# Altium schematic sheet PWR_Switch_PCB.SchDoc
size A1
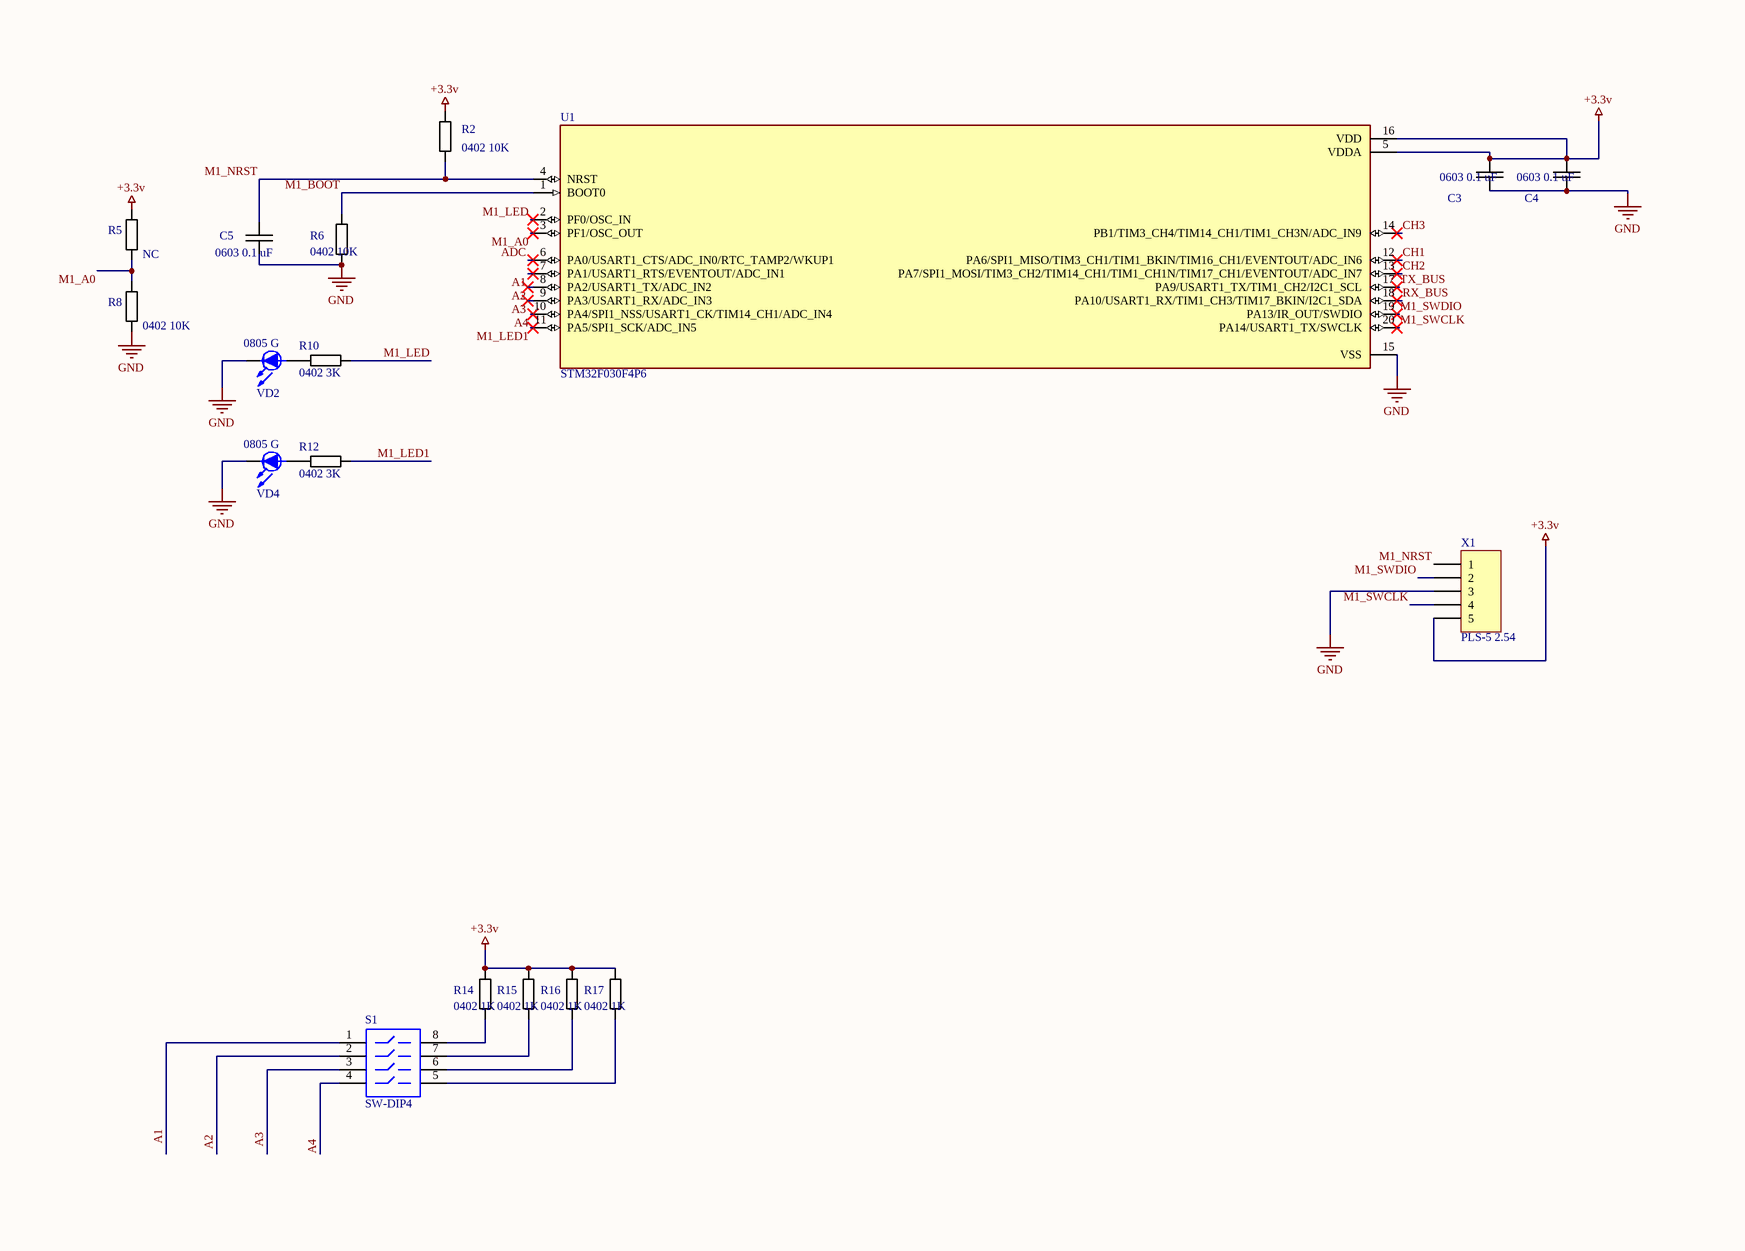
[diagram p0: PWR_Switch_PCB.SchDoc, top left]
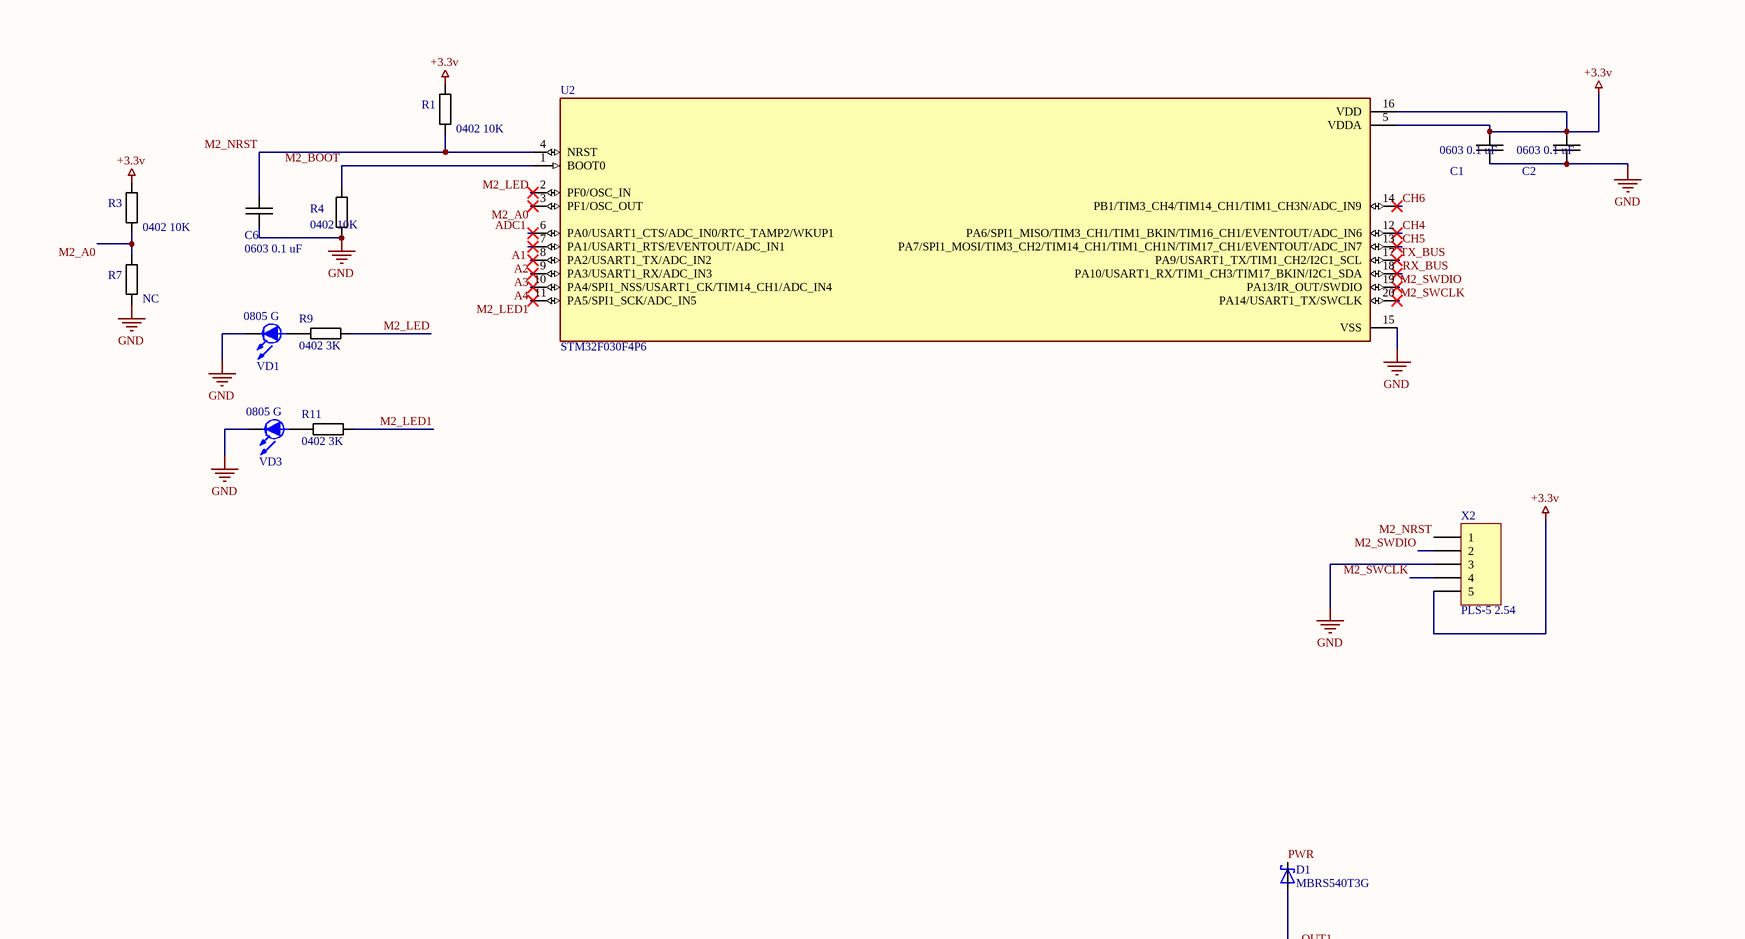
[diagram p1: PWR_Switch_PCB.SchDoc, top right]
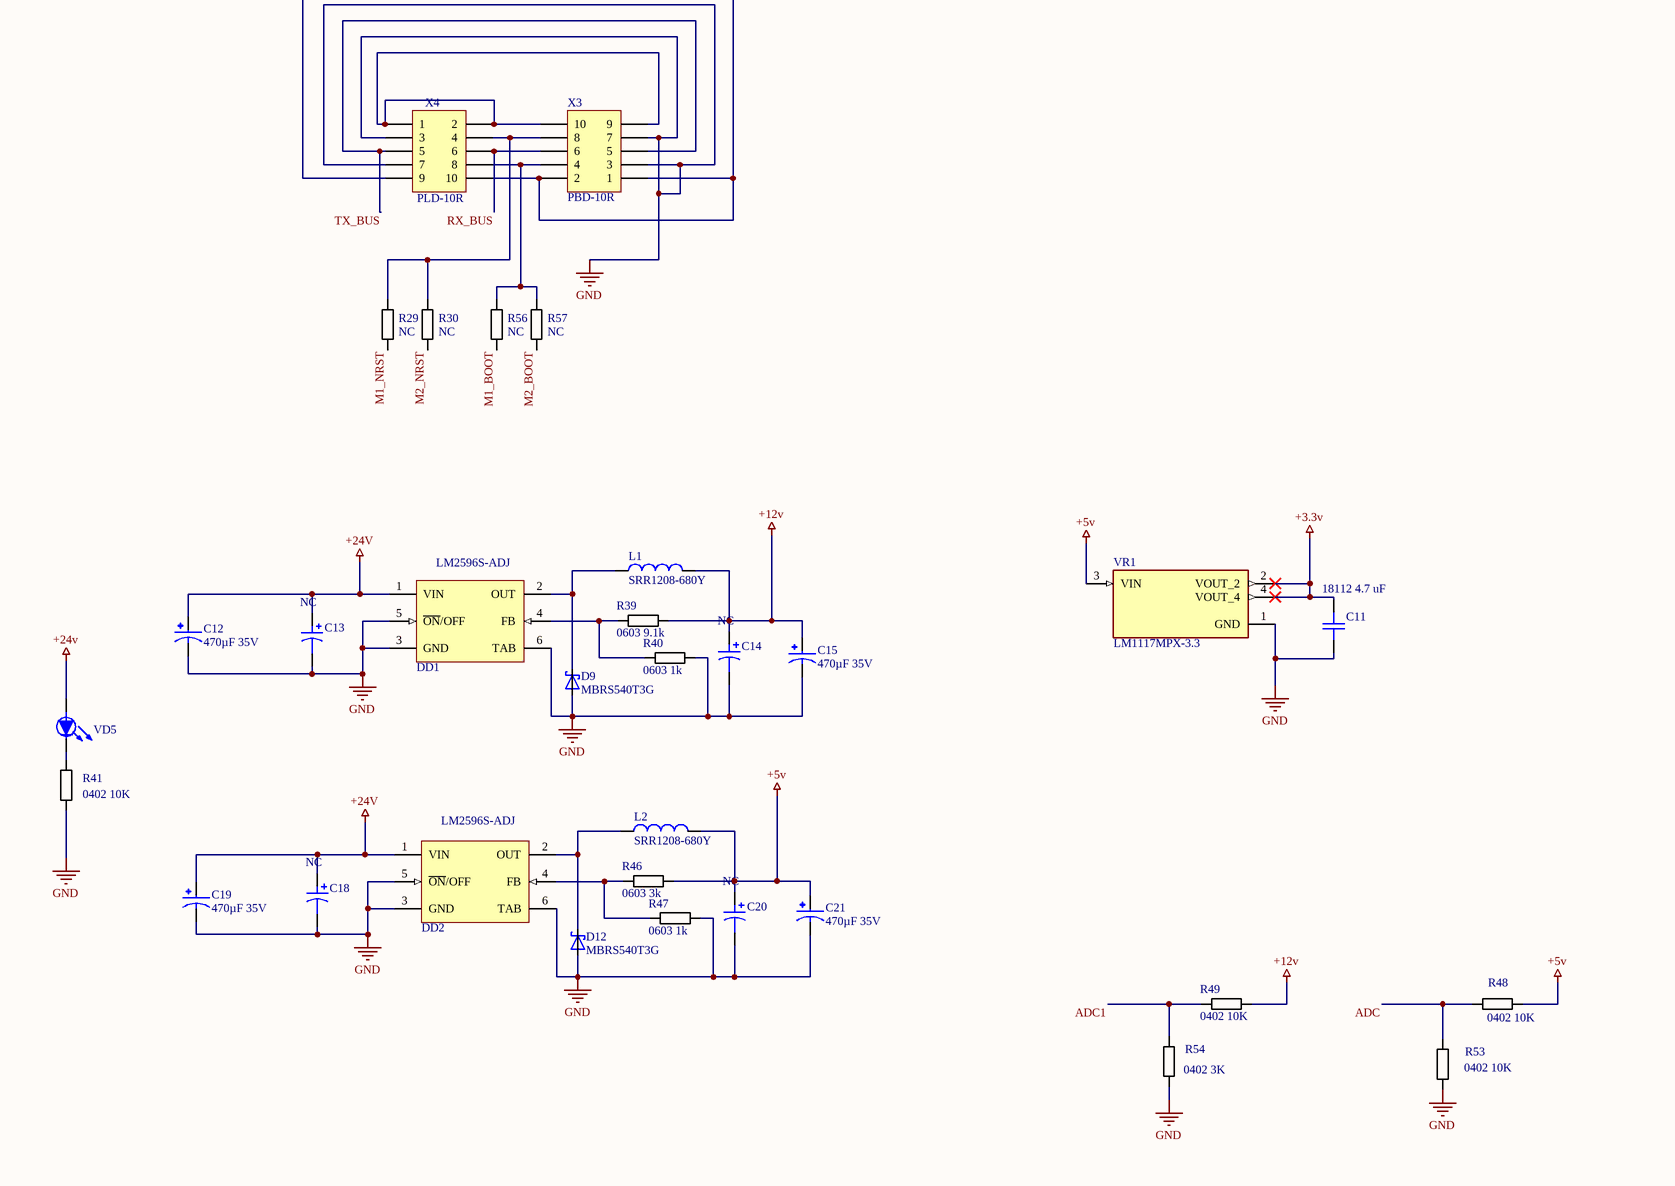
[diagram p2: PWR_Switch_PCB.SchDoc, bottom left]
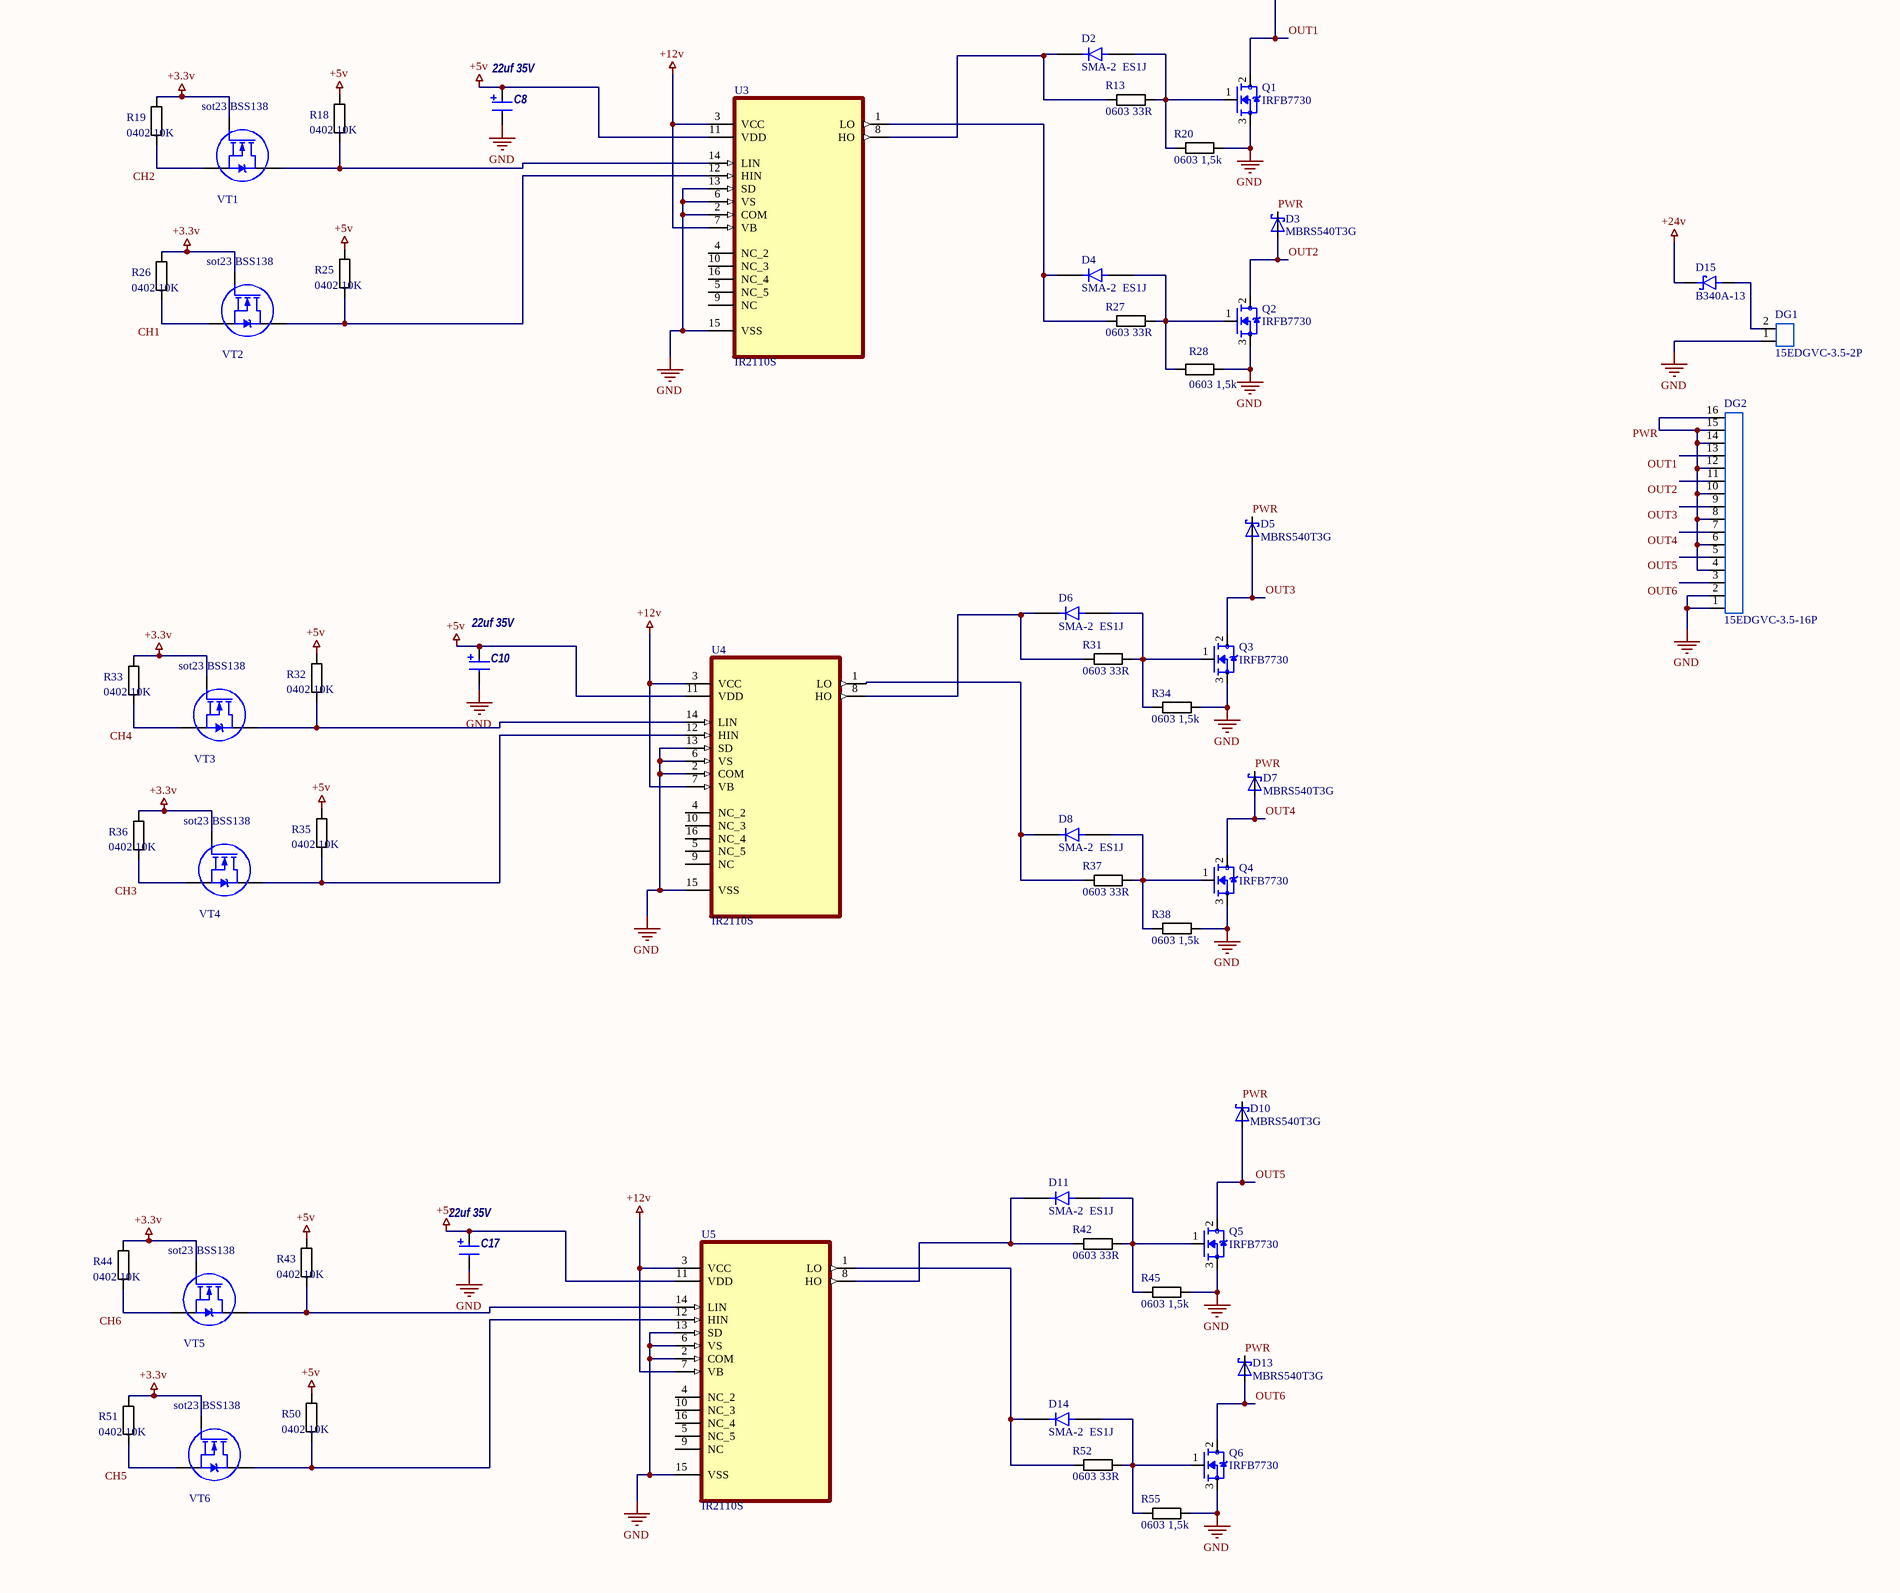
[diagram p3: PWR_Switch_PCB.SchDoc, bottom right]

## Parts
C1  0603 0.1 uF  [CAPACITOR 0603]
C2  0603 0.1 uF  [CAPACITOR 0603]
C3  0603 0.1 uF  [CAPACITOR 0603]
C4  0603 0.1 uF  [CAPACITOR 0603]
C5  0603 0.1 uF  [CAPACITOR 0603]
C6  0603 0.1 uF  [CAPACITOR 0603]
C8  22uf 35V  [C - EL_Tantal_TYPED]
C10  22uf 35V  [C - EL_Tantal_TYPED]
C11  18112 4.7 uF  [CAPCHIP1812]
C12  470µF 35V  [CAP_EEEFK1V471SV]
C13  NC  [ECR 10x13mm]
C14  NC  [ECR 10x13mm]
C15  470µF 35V  [CAP_EEEFK1V471SV]
C17  22uf 35V  [C - EL_Tantal_TYPED]
C18  NC  [ECR 10x13mm]
C19  470µF 35V  [CAP_EEEFK1V471SV]
C20  NC  [ECR 10x13mm]
C21  470µF 35V  [CAP_EEEFK1V471SV]
D1  MBRS540T3G  [DIOM7958X213N]
D2  SMA-2  ES1J  [DIO_ES1J]
D3  MBRS540T3G  [DIOM7958X213N]
D4  SMA-2  ES1J  [DIO_ES1J]
D5  MBRS540T3G  [DIOM7958X213N]
D6  SMA-2  ES1J  [DIO_ES1J]
D7  MBRS540T3G  [DIOM7958X213N]
D8  SMA-2  ES1J  [DIO_ES1J]
D9  MBRS540T3G  [DIOM7958X213N]
D10  MBRS540T3G  [DIOM7958X213N]
D11  SMA-2  ES1J  [DIO_ES1J]
D12  MBRS540T3G  [DIOM7958X213N]
D13  MBRS540T3G  [DIOM7958X213N]
D14  SMA-2  ES1J  [DIO_ES1J]
D15  B340A-13  [DIOM5226X240N]
DD1  LM2596S-ADJ  [TO-263]
DD2  LM2596S-ADJ  [TO-263]
DG1  15EDGVC-3.5-2P  [15EDGVC-3.5-16P]
DG2  15EDGVC-3.5-16P  [15EDGVC-3.5-16P]
L1  SRR1208-680Y  [SRR1208]
L2  SRR1208-680Y  [SRR1208]
Q1  IRFB7730  [up-miror]
Q2  IRFB7730  [up-miror]
Q3  IRFB7730  [up-miror]
Q4  IRFB7730  [up-miror]
Q5  IRFB7730  [up-miror]
Q6  IRFB7730  [up-miror]
R1  0402 10K  [Resistor 0402]
R2  0402 10K  [Resistor 0402]
R3  0402 10K  [Resistor 0402]
R4  0402 10K  [Resistor 0402]
R5  NC  [Resistor 0402]
R6  0402 10K  [Resistor 0402]
R7  NC  [Resistor 0402]
R8  0402 10K  [Resistor 0402]
R9  0402 3K  [Resistor 0402]
R10  0402 3K  [Resistor 0402]
R11  0402 3K  [Resistor 0402]
R12  0402 3K  [Resistor 0402]
R13  0603 33R  [Resistor 0603]
R14  0402 1K  [Resistor 0402]
R15  0402 1K  [Resistor 0402]
R16  0402 1K  [Resistor 0402]
R17  0402 1K  [Resistor 0402]
R18  0402 10K  [Resistor 0402]
R19  0402 10K  [Resistor 0402]
R20  0603 1,5k  [Resistor 0603]
R25  0402 10K  [Resistor 0402]
R26  0402 10K  [Resistor 0402]
R27  0603 33R  [Resistor 0603]
R28  0603 1,5k  [Resistor 0603]
R29  NC  [Resistor 0402]
R30  NC  [Resistor 0402]
R31  0603 33R  [Resistor 0603]
R32  0402 10K  [Resistor 0402]
R33  0402 10K  [Resistor 0402]
R34  0603 1,5k  [Resistor 0603]
R35  0402 10K  [Resistor 0402]
R36  0402 10K  [Resistor 0402]
R37  0603 33R  [Resistor 0603]
R38  0603 1,5k  [Resistor 0603]
R39  0603 9.1k  [Resistor 0603]
R40  0603 1k  [Resistor 0603]
R41  0402 10K  [Resistor 0402]
R42  0603 33R  [Resistor 0603]
R43  0402 10K  [Resistor 0402]
R44  0402 10K  [Resistor 0402]
R45  0603 1,5k  [Resistor 0603]
R46  0603 3k  [Resistor 0603]
R47  0603 1k  [Resistor 0603]
R48  0402 10K  [Resistor 0402]
R49  0402 10K  [Resistor 0402]
R50  0402 10K  [Resistor 0402]
R51  0402 10K  [Resistor 0402]
R52  0603 33R  [Resistor 0603]
R53  0402 10K  [Resistor 0402]
R54  0402 3K  [Resistor 0402]
R55  0603 1,5k  [Resistor 0603]
R56  NC  [Resistor 0402]
R57  NC  [Resistor 0402]
S1  SW-DIP4  [DIP-8]
U1  STM32F030F4P6  [SOP65P640X120-20N]
U2  STM32F030F4P6  [SOP65P640X120-20N]
U3  IR2110S  [SOIC127P1032X265-16N]
U4  IR2110S  [SOIC127P1032X265-16N]
U5  IR2110S  [SOIC127P1032X265-16N]
VD1  0805 G  [0805-]
VD2  0805 G  [0805-]
VD3  0805 G  [0805-]
VD4  0805 G  [0805-]
VD5  0805 G  [0805-]  (value not drawn)
VR1  LM1117MPX-3.3  [VREG_LM1117MPX-3.3]
VT1  sot23 BSS138  [SOT23]
VT2  sot23 BSS138  [SOT23]
VT3  sot23 BSS138  [SOT23]
VT4  sot23 BSS138  [SOT23]
VT5  sot23 BSS138  [SOT23]
VT6  sot23 BSS138  [SOT23]
X1  PLS-5 2.54  [PLS-5-3D]
X2  PLS-5 2.54  [PLS-5-3D]
X3  PBD-10R  [PBD-10RR]
X4  PLD-10R  [PLD-10RR2]

## Nets
+3.3v: C1.1 C2.1 C3.1 C4.1 C11.2 R1.2 R2.2 R3.2 R5.2 R14.1 R15.1 R16.1 R17.1 R19.1 R26.1 R33.1 R36.1 R44.1 R51.1 U1.5(VDDA) U1.16(VDD) U2.5(VDDA) U2.16(VDD) VR1.2(VOUT_2) VR1.4(VOUT_4) VT1.1(G) VT2.1(G) VT3.1(G) VT4.1(G) VT5.1(G) VT6.1(G) X1.5 X2.5
+5v: C8.1 C10.1 C17.1 C20.1 C21.1 L2.P$2 R18.1 R25.1 R32.1 R35.1 R43.1 R46.2 R48.1 R50.1 U3.11(VDD) U4.11(VDD) U5.11(VDD) VR1.3(VIN)
+12v: C14.1 C15.1 L1.P$2 R39.2 R49.1 U3.3(VCC) U3.7(VB) U4.3(VCC) U4.7(VB) U5.3(VCC) U5.7(VB)
+24v: C12.1 C13.1 C18.1 C19.1 D15.C DD1.1(VIN) DD2.1(VIN) VD5.A(a)
GND: C1.2 C2.2 C3.2 C4.2 C5.1 C6.1 C8.2 C10.2 C11.1 C12.2 C13.2 C14.2 C15.2 C17.2 C18.2 C19.2 C20.2 C21.2 D9.A D12.A DD1.3(GND) DD1.5(~{ON}/OFF) DD1.6(TAB) DD2.3(GND) DD2.5(~{ON}/OFF) DD2.6(TAB) DG1.1 DG2.1 DG2.2 Q1.3(S) Q2.3(S) Q3.3(S) Q4.3(S) Q5.3(S) Q6.3(S) R4.2 R6.2 R7.1 R8.1 R20.2 R28.2 R34.2 R38.2 R40.2 R41.1 R45.2 R47.2 R53.1 R54.1 R55.2 U1.15(VSS) U2.15(VSS) U3.2(COM) U3.6(VS) U3.13(SD) U3.15(VSS) U4.2(COM) U4.6(VS) U4.13(SD) U4.15(VSS) U5.2(COM) U5.6(VS) U5.13(SD) U5.15(VSS) VD1.K(k) VD2.K(k) VD3.K(k) VD4.K(k) VR1.1(GND) X1.3 X2.3 X3.3 X3.7 X4.3 X4.7
A1: S1.1 U1.7(PA1/USART1_RTS/EVENTOUT/ADC_IN1) U2.7(PA1/USART1_RTS/EVENTOUT/ADC_IN1)
A2: S1.2 U1.8(PA2/USART1_TX/ADC_IN2) U2.8(PA2/USART1_TX/ADC_IN2)
A3: S1.3 U1.9(PA3/USART1_RX/ADC_IN3) U2.9(PA3/USART1_RX/ADC_IN3)
A4: S1.4 U1.10(PA4/SPI1_NSS/USART1_CK/TIM14_CH1/ADC_IN4) U2.10(PA4/SPI1_NSS/USART1_CK/TIM14_CH1/ADC_IN4)
ADC: R48.2 R53.2 U1.6(PA0/USART1_CTS/ADC_IN0/RTC_TAMP2/WKUP1)
ADC1: R49.2 R54.2 U2.6(PA0/USART1_CTS/ADC_IN0/RTC_TAMP2/WKUP1)
CH1: R26.2 U1.12(PA6/SPI1_MISO/TIM3_CH1/TIM1_BKIN/TIM16_CH1/EVENTOUT/ADC_IN6) VT2.2(S)
CH2: R19.2 U1.13(PA7/SPI1_MOSI/TIM3_CH2/TIM14_CH1/TIM1_CH1N/TIM17_CH1/EVENTOUT/ADC_IN7) VT1.2(S)
CH3: R36.2 U1.14(PB1/TIM3_CH4/TIM14_CH1/TIM1_CH3N/ADC_IN9) VT4.2(S)
CH4: R33.2 U2.12(PA6/SPI1_MISO/TIM3_CH1/TIM1_BKIN/TIM16_CH1/EVENTOUT/ADC_IN6) VT3.2(S)
CH5: R51.2 U2.13(PA7/SPI1_MOSI/TIM3_CH2/TIM14_CH1/TIM1_CH1N/TIM17_CH1/EVENTOUT/ADC_IN7) VT6.2(S)
CH6: R44.2 U2.14(PB1/TIM3_CH4/TIM14_CH1/TIM1_CH3N/ADC_IN9) VT5.2(S)
M1_A0: R5.1 R8.2 U1.3(PF1/OSC_OUT)
M1_BOOT: R6.1 R56.2 U1.1(BOOT0)
M1_LED: R10.1 U1.2(PF0/OSC_IN)
M1_LED1: R12.1 U1.11(PA5/SPI1_SCK/ADC_IN5)
M1_NRST: C5.2 R2.1 R29.2 U1.4(NRST) X1.1
M1_SWCLK: U1.20(PA14/USART1_TX/SWCLK) X1.4
M1_SWDIO: U1.19(PA13/IR_OUT/SWDIO) X1.2
M2_A0: R3.1 R7.2 U2.3(PF1/OSC_OUT)
M2_BOOT: R4.1 R57.2 U2.1(BOOT0)
M2_LED: R9.1 U2.2(PF0/OSC_IN)
M2_LED1: R11.1 U2.11(PA5/SPI1_SCK/ADC_IN5)
M2_NRST: C6.2 R1.1 R30.2 U2.4(NRST) X2.1
M2_SWCLK: U2.20(PA14/USART1_TX/SWCLK) X2.4
M2_SWDIO: U2.19(PA13/IR_OUT/SWDIO) X2.2
OUT1: D1.A DG2.13 Q1.2(D)
OUT2: D3.A DG2.11 Q2.2(D)
OUT3: D5.A DG2.9 Q3.2(D)
OUT4: D7.A DG2.7 Q4.2(D)
OUT5: D10.A DG2.5 Q5.2(D)
OUT6: D13.A DG2.3 Q6.2(D)
PWR: D1.C D3.C D5.C D7.C D10.C D13.C DG2.4 DG2.6 DG2.8 DG2.10 DG2.12 DG2.14 DG2.15 DG2.16
RX_BUS: U1.18(PA10/USART1_RX/TIM1_CH3/TIM17_BKIN/I2C1_SDA) U2.18(PA10/USART1_RX/TIM1_CH3/TIM17_BKIN/I2C1_SDA) X3.6 X4.6
TX_BUS: U1.17(PA9/USART1_TX/TIM1_CH2/I2C1_SCL) U2.17(PA9/USART1_TX/TIM1_CH2/I2C1_SCL) X3.5 X4.5
NetD2_A: D2.A Q1.1(G) R13.2 R20.1
NetD2_K: D2.K R13.1 U3.8(HO)
NetD4_A: D4.A Q2.1(G) R27.2 R28.1
NetD4_K: D4.K R27.1 U3.1(LO)
NetD6_A: D6.A Q3.1(G) R31.2 R34.1
NetD6_K: D6.K R31.1 U4.8(HO)
NetD8_A: D8.A Q4.1(G) R37.2 R38.1
NetD8_K: D8.K R37.1 U4.1(LO)
NetD9_C: D9.C DD1.2(OUT) L1.P$1
NetD11_A: D11.A Q5.1(G) R42.2 R45.1
NetD11_K: D11.K R42.1 U5.8(HO)
NetD12_C: D12.C DD2.2(OUT) L2.P$1
NetD14_A: D14.A Q6.1(G) R52.2 R55.1
NetD14_K: D14.K R52.1 U5.1(LO)
NetD15_A: D15.A DG1.2
NetDD1_4: DD1.4(FB) R39.1 R40.1
NetDD2_4: DD2.4(FB) R46.1 R47.1
NetR9_2: R9.2 VD1.A(a)
NetR10_2: R10.2 VD2.A(a)
NetR11_2: R11.2 VD3.A(a)
NetR12_2: R12.2 VD4.A(a)
NetR14_2: R14.2 S1.8
NetR15_2: R15.2 S1.7
NetR16_2: R16.2 S1.6
NetR17_2: R17.2 S1.5
NetR18_2: R18.2 U3.14(LIN) VT1.3(D)
NetR25_2: R25.2 U3.12(HIN) VT2.3(D)
NetR29_1: R29.1 R30.1 X3.8 X4.4
NetR32_2: R32.2 U4.14(LIN) VT3.3(D)
NetR35_2: R35.2 U4.12(HIN) VT4.3(D)
NetR41_2: R41.2 VD5.K(k)
NetR43_2: R43.2 U5.14(LIN) VT5.3(D)
NetR50_2: R50.2 U5.12(HIN) VT6.3(D)
NetR56_1: R56.1 R57.1 X3.4 X4.8
NetX3_1: X3.1 X3.2 X4.9 X4.10
NetX3_9: X3.9 X3.10 X4.1 X4.2

Not connected (* = marked no-connect by the designer): U3 4(NC_2) 5(NC_5) 9(NC) 10(NC_3) 16(NC_4); U4 4(NC_2) 5(NC_5) 9(NC) 10(NC_3) 16(NC_4); U5 4(NC_2) 5(NC_5) 9(NC) 10(NC_3) 16(NC_4)

## Library data of the parts
C1-C6 = Capasitor: Ceramic Capacitor; Value: 0603 0.1 uF; Package: 0603
C8 C10 C17 = C - EL_Tantal_SMD_TypeD: Tantal TypeD HGD226K035T; Indication: {Indication}; Value: 22uf 35V; Name: HGD226K035T
C11 = Cap C: Ceramic Capacitor; Class: Электронные компоненты; SubClass: Конденсаторы; TKE: {TKE}; Ordering_Information: {Ordering_Information}; Installation: {Installation}; Body: {Body}; Nominal_voltage_V: {Nominal_voltage_V}; Tolerance_Percent: {Tolerance_Percent}; Pins: {Pins}; Value: 18112 4.7 uF; Package: 1812
C12 C15 C19 C21 = EEEFK1V471SV: EEEFK1V471SV 470µF 35V Aluminum Electrolytic Capacitors Radial, Can - SMD 80mOhm @ 100kHz 2000 Hrs @ 105°C; MP: EEE-FK1V471SV; MF: Panasonic Electronic Components; Package: RADIAL-2 Panasonic; Availability: In Stock; Value: 470µF 35V; SnapEDA_Link: https://www.snapeda.com/parts/EEE-FK1V471SV/Panasonic/view-part/?ref=snap; Price: None; Check_prices: https://www.snapeda.com/parts/EEE-FK1V471SV/Panasonic/view-part/?ref=eda; Purchase-URL: https://pricing.snapeda.com/search/part/EEE-FK1V471SV/?ref=eda
C13 C14 C18 C20 = Cap Pol: Polarized Capacitor (Rad) 220uF 50v; Type: 10x13; Voltage: 50; URL: http://www.hitano.com.tw/PDF/ECR_081225.pdf; Value: NC
D1 D3 D5 D7 D9 D10 D12 D13 = MBRS540T3G: Diode Schottky 40V 5A Surface Mount SMC; MF: ON Semiconductor; SnapEDA_Link: https://www.snapeda.com/parts/MBRS540T3G/ON%20Semiconductor/view-part/78777/?ref=snap; MP: MBRS540T3G; Availability: Unavailable; Price: None; Value: MBRS540T3G; Package: DO-214 ON Semiconductor
D2 D4 D6 D8 D11 D14 = ES1J: Diode Standard 600V 1A Surface Mount SMA (DO-214AC); MF: ON Semiconductor; Arrow_Electronics-Purchase-URL: https://snapeda.com/shop?store=Arrow+Electronics&id=1637442; DigiKey-Purchase-URL: https://snapeda.com/shop?store=DigiKey&id=1637442; Package: SMA-2 ON Semiconductor; Availability: Good; SnapEDA_Link: https://www.snapeda.com/parts/ES1J/ON%20Semiconductor/view-part/1637442/?ref=snap; MP: ES1J; Mouser-Purchase-URL: https://snapeda.com/shop?store=Mouser&id=1637442; Value: SMA-2  ES1J; Price: None; BuyPart: https://www.snapeda.com/parts/ES1J/ON%20Semiconductor/view-part/1637442/?ref=eda
D15 = B340A-13: Diode Schottky 40 V 3A Surface Mount SMA; MF: Diodes Inc.; Value: B340A-13; MP: B340A-13; Package: DO-214 Diodes Inc.; Availability: In Stock; Price: None; SnapEDA_Link: https://www.snapeda.com/parts/B340A-13/Diodes+Inc./view-part/?ref=snap; Check_prices: https://www.snapeda.com/parts/B340A-13/Diodes+Inc./view-part/?ref=eda; Purchase-URL: https://pricing.snapeda.com/search/part/B340A-13/?ref=eda
DD1 DD2 = LM2596S-ADJ: SIMPLE SWITCHER® Power Converter 150 KHz 3A Step-Down Voltage Regulator, 5-pin TO-263; Manufacturer: National Semiconductor; Published: 13.04.2012; Publisher: Reukov A.V.; PartNumber: LM2596S-ADJ; CompType: Switcher; ComponentLink1URL: http://www.national.com/ds/LM/LM2596.pdf; ComponentLink2URL: http://www.national.com/pf/LM/LM2596.html; ComponentLink3URL: http://www.national.com/packaging/folders/ts5b.html; Value: LM2596S-ADJ
L1 L2 = SRR1208-6R5ML: 68µH Shielded Wirewound Inductor 1.8A 18mOhm Max Nonstandard; MF: Bourns; Availability: Unavailable; SnapEDA_Link: https://www.snapeda.com/parts/SRR1208-6R5ML/Bourns/view-part/353452/?ref=snap; Value: SRR1208-680Y; Package: Nonstandard Bourns; MP: SRR1208-6R5ML; Price: None
Q1-Q6 = IRF: N-Channel Power Transistor - TO-220; MP: IPP037N06L3_G; Package: None; Price: None; Value: IRFB7730; Availability: Unavailable
R1-R20 R25-R57 = Resistor
  R1-R4 R6 R8 R18 R19 R25 R26 R32 R33 R35 R36 R41 R43 R44 R48-R51 R53: Value: 0402 10K; Package: 0402
  R5 R7 R29 R30 R56 R57: Value: NC; Package: 0402
  R9-R12 R54: Value: 0402 3K; Package: 0402
  R13 R27 R31 R37 R42 R52: Value: 0603 33R; Package: 0603
  R14-R17: Value: 0402 1K; Package: 0402
  R20 R28 R34 R38 R45 R55: Value: 0603 1,5k; Package: 0603
  R39: Value: 0603 9.1k; Package: 0603
  R40 R47: Value: 0603 1k; Package: 0603
  R46: Value: 0603 3k; Package: 0603
S1 = SW-DIP4: DIP Switch; Published: 24-Mar-1999; LatestRevisionDate: 17-Jul-2002; LatestRevisionNote: Re-released for DXP Platform.; PackageReference: DIP-8; Publisher: Altium Limited; value: SW-DIP4
U1 U2 = STM32F030F4P6: MCU 32-bit STM32F ARM Cortex M0 RISC 16KB Flash 2.5V/3.3V 20-Pin TSSOP Tray; Value: STM32F030F4P6; Availability: Unavailable; Price: None; MP: STM32F030F4P6; Package: None
U3-U5 = IR2110S: Half-Bridge Gate Driver IC Non-Inverting 16-SOIC; MF: Infineon; SnapEDA_Link: https://www.snapeda.com/parts/IR2110S/Infineon+Technologies/view-part/?ref=snap; Availability: In Stock; MP: IR2110S; Purchase-URL: https://pricing.snapeda.com/search/part/IR2110S/?ref=eda; Price: None; Value: IR2110S; Check_prices: https://www.snapeda.com/parts/IR2110S/Infineon+Technologies/view-part/?ref=eda; Package: SOIC-16 International Rectifier
VD1-VD4 = LED SMD: Green; CompType: LED; Note: Read; Value: 0805 G; Pins: 2; Package: 0805
VD5 = LED SMD: Green; Class: Электронные компоненты; SubClass: Светодиоды; Pitch_mm: {Pitch_mm}; Ordering_Information: {Ordering_Information}; Luminous_intensity_mcd: {Luminous_intensity_mcd}; Diameter_mm: {Diameter_mm}; Color: {Color}; Installation: {Installation}; Body: {Body}; Value: 0805 G; Pins: 2
VR1 = LM1117MPX-3.3: 800-mA 3.3-V linear voltage regulator; MF: Texas Instruments; Check_prices: https://www.snapeda.com/parts/LM1117MPX-3.3/Texas+Instruments/view-part/?ref=eda; Value: LM1117MPX-3.3; Availability: In Stock; MP: LM1117MPX-3.3; Price: None; Package: SOT-223-4 Texas Instruments; SnapEDA_Link: https://www.snapeda.com/parts/LM1117MPX-3.3/Texas+Instruments/view-part/?ref=snap; Purchase-URL: https://pricing.snapeda.com/search/part/LM1117MPX-3.3/?ref=eda
VT1-VT6 = BSS138: N-Channel Power MOSFET; Published: 17.04.2012; Publisher: Reukov A.V.; value: sot23 BSS138; Package: SOT23
X1 X2 = PLS-5: Header, 5-Pin; CompType: connector; Note: header pins 2.54mm x 5; Value: PLS-5 2.54; Package: 2.54 x 5; PartNumber: PLS-5; Pins: 5
X3 = PBD-10R: Header, 5-Pin, Dual row; Value: KLS1-208-2-10-R; Package: PBD-10R
X4 = PLD-10R: Header, 5-Pin, Dual row; Value: KLS1-207-2-10-R1; Package: PLD-10R
DG1 = 15EDGVC-3.5-2P: value: 15EDGVC-3.5-2P
DG2 = 15EDGVC-3.5-16P: value: 15EDGVC-3.5-16P